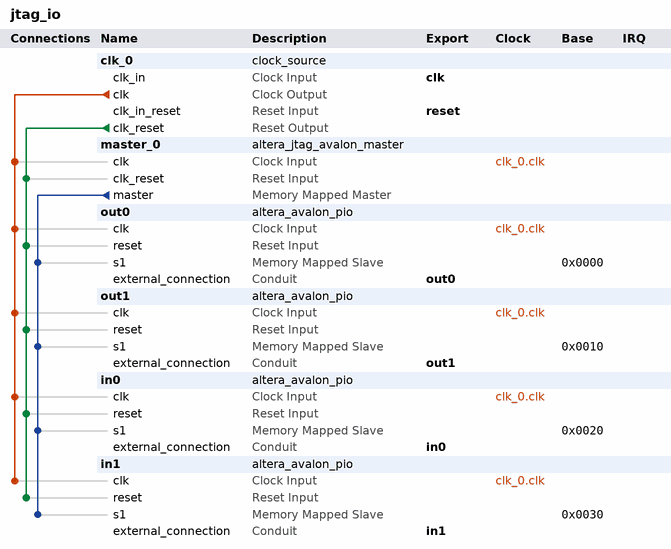
[diagram p0: system contents]
# Platform Designer (Qsys) system jtag_io, Cyclone V 5CSEBA6U23I7
# Parameters at their usual value, and those the tool derives, are not listed.
package require -exact qsys 20.1
create_system jtag_io
set_project_property DEVICE_FAMILY {Cyclone V}
set_project_property DEVICE 5CSEBA6U23I7

add_instance clk_0 clock_source 20.1
set_instance_parameter_value clk_0 clockFrequency 50000000

add_instance master_0 altera_jtag_avalon_master 20.1

add_instance out0 altera_avalon_pio 20.1
set_instance_parameter_value out0 direction Output
set_instance_parameter_value out0 width 32

add_instance out1 altera_avalon_pio 20.1
set_instance_parameter_value out1 direction Output
set_instance_parameter_value out1 width 32

add_instance in0 altera_avalon_pio 20.1
set_instance_parameter_value in0 direction Input
set_instance_parameter_value in0 width 32

add_instance in1 altera_avalon_pio 20.1
set_instance_parameter_value in1 direction Input
set_instance_parameter_value in1 width 32

# connections
add_connection clk_0.clk in0.clk clock
add_connection clk_0.clk in1.clk clock
add_connection clk_0.clk master_0.clk clock
add_connection clk_0.clk out0.clk clock
add_connection clk_0.clk out1.clk clock
add_connection clk_0.clk_reset in0.reset reset
add_connection clk_0.clk_reset in1.reset reset
add_connection clk_0.clk_reset master_0.clk_reset reset
add_connection clk_0.clk_reset out0.reset reset
add_connection clk_0.clk_reset out1.reset reset
add_connection master_0.master in0.s1 avalon
set_connection_parameter_value master_0.master/in0.s1 baseAddress 0x0020
add_connection master_0.master in1.s1 avalon
set_connection_parameter_value master_0.master/in1.s1 baseAddress 0x0030
add_connection master_0.master out0.s1 avalon
set_connection_parameter_value master_0.master/out0.s1 baseAddress 0x0000
add_connection master_0.master out1.s1 avalon
set_connection_parameter_value master_0.master/out1.s1 baseAddress 0x0010

# exported interfaces
add_interface clk clock sink
set_interface_property clk EXPORT_OF clk_0.clk_in
add_interface in0 conduit end
set_interface_property in0 EXPORT_OF in0.external_connection
add_interface in1 conduit end
set_interface_property in1 EXPORT_OF in1.external_connection
add_interface out0 conduit end
set_interface_property out0 EXPORT_OF out0.external_connection
add_interface out1 conduit end
set_interface_property out1 EXPORT_OF out1.external_connection
add_interface reset reset sink
set_interface_property reset EXPORT_OF clk_0.clk_in_reset

set_interconnect_requirement {$system} qsys_mm.clockCrossingAdapter HANDSHAKE
set_interconnect_requirement {$system} qsys_mm.enableEccProtection FALSE
set_interconnect_requirement {$system} qsys_mm.insertDefaultSlave FALSE
set_interconnect_requirement {$system} qsys_mm.maxAdditionalLatency 1

save_system jtag_io.qsys
